# EAGLE design synth-zodiac-sw-test (EAGLE 9.6.2)
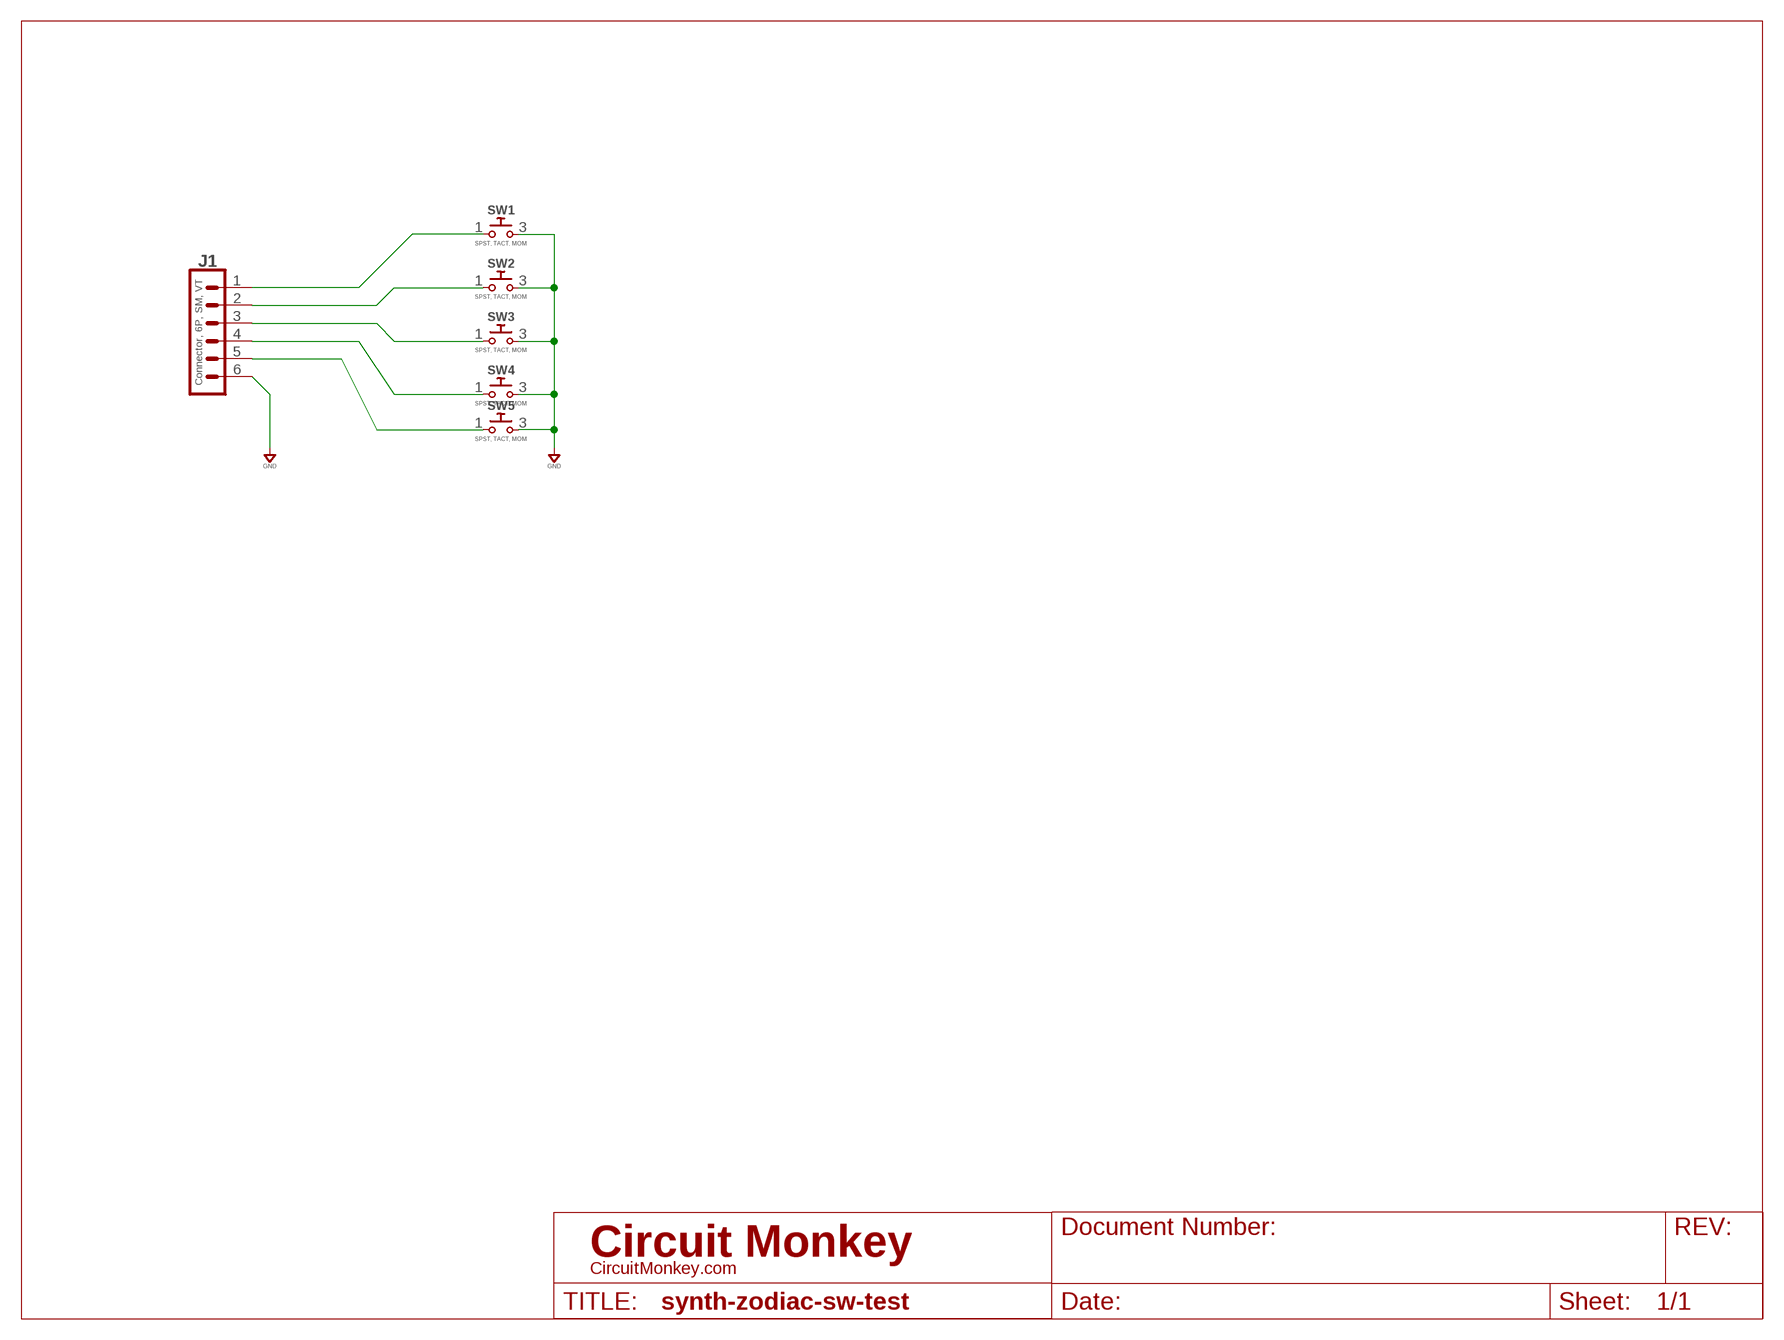
[diagram p0: schematic, sheet 1]

## Parts
J1  Connector, 6P, SM, VT  06P-SM-VT-SMT  [BM06B-SRSS-TB]
SW1  SPST, TACT, MOM  PUSHBTN-MOMB3FS-BLIND  [B3FS-BACKMOUNT]
SW2  SPST, TACT, MOM  PUSHBTN-MOMB3FS-BLIND  [B3FS-BACKMOUNT]
SW3  SPST, TACT, MOM  PUSHBTN-MOMB3FS-BLIND  [B3FS-BACKMOUNT]
SW4  SPST, TACT, MOM  PUSHBTN-MOMB3FS-BLIND  [B3FS-BACKMOUNT]
SW5  SPST, TACT, MOM  PUSHBTN-MOMB3FS-BLIND  [B3FS-BACKMOUNT]

## Nets
GND: J1.6 SW1.3 SW2.3 SW3.3 SW4.3 SW5.3
N$1: J1.5 SW5.1
N$2: J1.4 SW4.1
N$3: J1.3 SW3.1
N$4: J1.2 SW2.1
N$5: J1.1 SW1.1

## Library data of the parts
J1 = con-jst:06P: Connector, 6P; COST01: 0.60; COST10: 0.52; COST100: 0.49; MFR: JST; MPN: BM06-SRSS-TB
SW1-SW5 = switch-smd:PUSHBTN-MOM: Pushbutton Switch; COST01: 0.15; COST10: 0.12; COST100: 0.09; MFR: CK; MPN: B3FS; MPN2: Tayda A-3961(2.3mm), A-5134(3.14mm,RA)

## Board
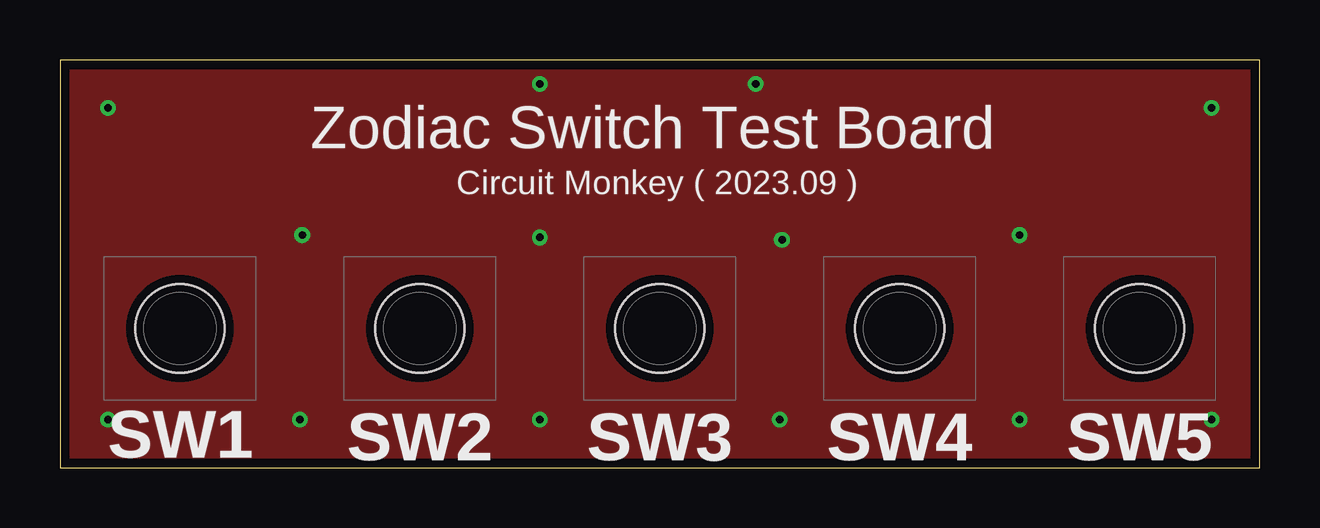
[diagram p1: board, top side]
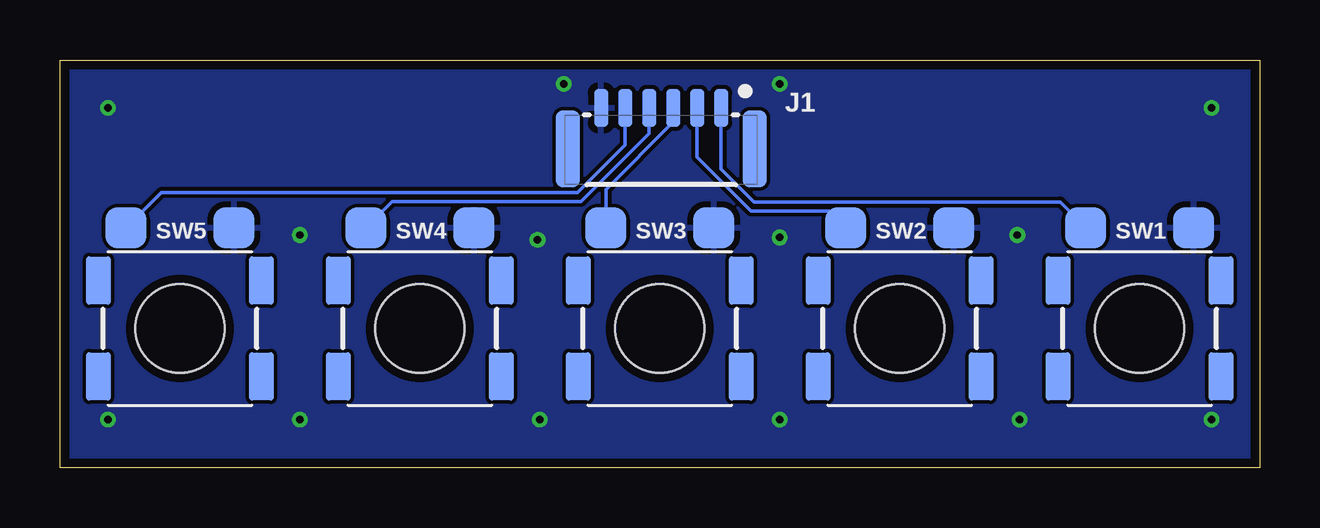
[diagram p2: board, bottom side, seen from below]

Size 50 x 17 mm. Coordinates in mm from the lower left corner, seen from the top.
Outline: 0,0 50,0 50,17 0,17 0,0
Copper layers (1*16): Top 0.0356mm / dielectric 1.5011mm / Bottom 0.0356mm
Design rules "OSH-CircuitMonkey": minimum track width 6mil, minimum drill 12mil, track to track 6mil, track to pad 6mil, pad to pad 6mil, via to via 6mil, smd to smd 6mil, copper to edge 15mil, drill to drill 6mil, minimum pad ring 7mil, minimum via ring 7mil, stop-mask expansion 3mil, vias tented up to drill 13mil, thermal gap 10mil

### Footprints (pad centres in the part's own frame; a part is rotated, then mirrored left to right if it is on the bottom)
BM06B-SRSS-TB = smd 0.6 x 1.6: 1 -2.5,-0.3; 2 -1.5,-0.3; 3 -0.5,-0.3; 4 0.5,-0.3; 5 1.5,-0.3; 6 2.5,-0.3 | smd 1 x 3.2: MTG1 3.9,1.4; MTG2 -3.9,1.4
B3FS-BACKMOUNT = smd 1.7 x 1.7 bottom: 1 4.2,-2.25; 3 4.2,2.25 | smd 2 x 1 bottom: MT1 -2,3.4; MT2 2,3.4; MT3 -2,-3.4; MT4 2,-3.4 | hole 3.7: 0,0

### Placement (x,y rotation side)
J1  24.94,14.7 180 bottom
SW1  5,5.8 90 top
SW2  15,5.8 90 top
SW3  25,5.8 90 top
SW4  35,5.8 90 top
SW5  45,5.8 90 top

### Tracks (layer width: path | path; a pad name or v marks a point on that pad's centre or on a via)
GND  (via drill 0.3)
  other vias: 2,15 48,15 48,2 2,2 20,2 30,2 10,2 40,2 29,16 20,16 20,9.6 30.1,9.5 40,9.7 10.1,9.7
  pour Top: 0,0 0,17 50,17 50,0
  pour Bottom: 50,0 50,17 0,17 0,0
N$1
  Bottom 0.152: J1.5 26.44,13.45 28.42,11.47 45.78,11.47 SW5.1
N$2
  Bottom 0.152: J1.4 25.44,13.94 28.27,11.1 36.15,11.1 SW4.1
N$3
  Bottom 0.152: J1.3 24.44,14.41 27.25,11.6 SW3.1
N$4
  Bottom 0.152: SW2.1 17.95,10.7 21.2,10.7 23.44,12.94 J1.2
N$5
  Bottom 0.152: J1.1 22.44,12.44 21.08,11.08 8.3,11.08 7.25,10.03 SW1.1

### Text on the board
tPlace: Zodiac Switch Test Board | Circuit Monkey ( 2023.09 )